# EAGLE design RFM69CW_BOB (EAGLE 6.4)
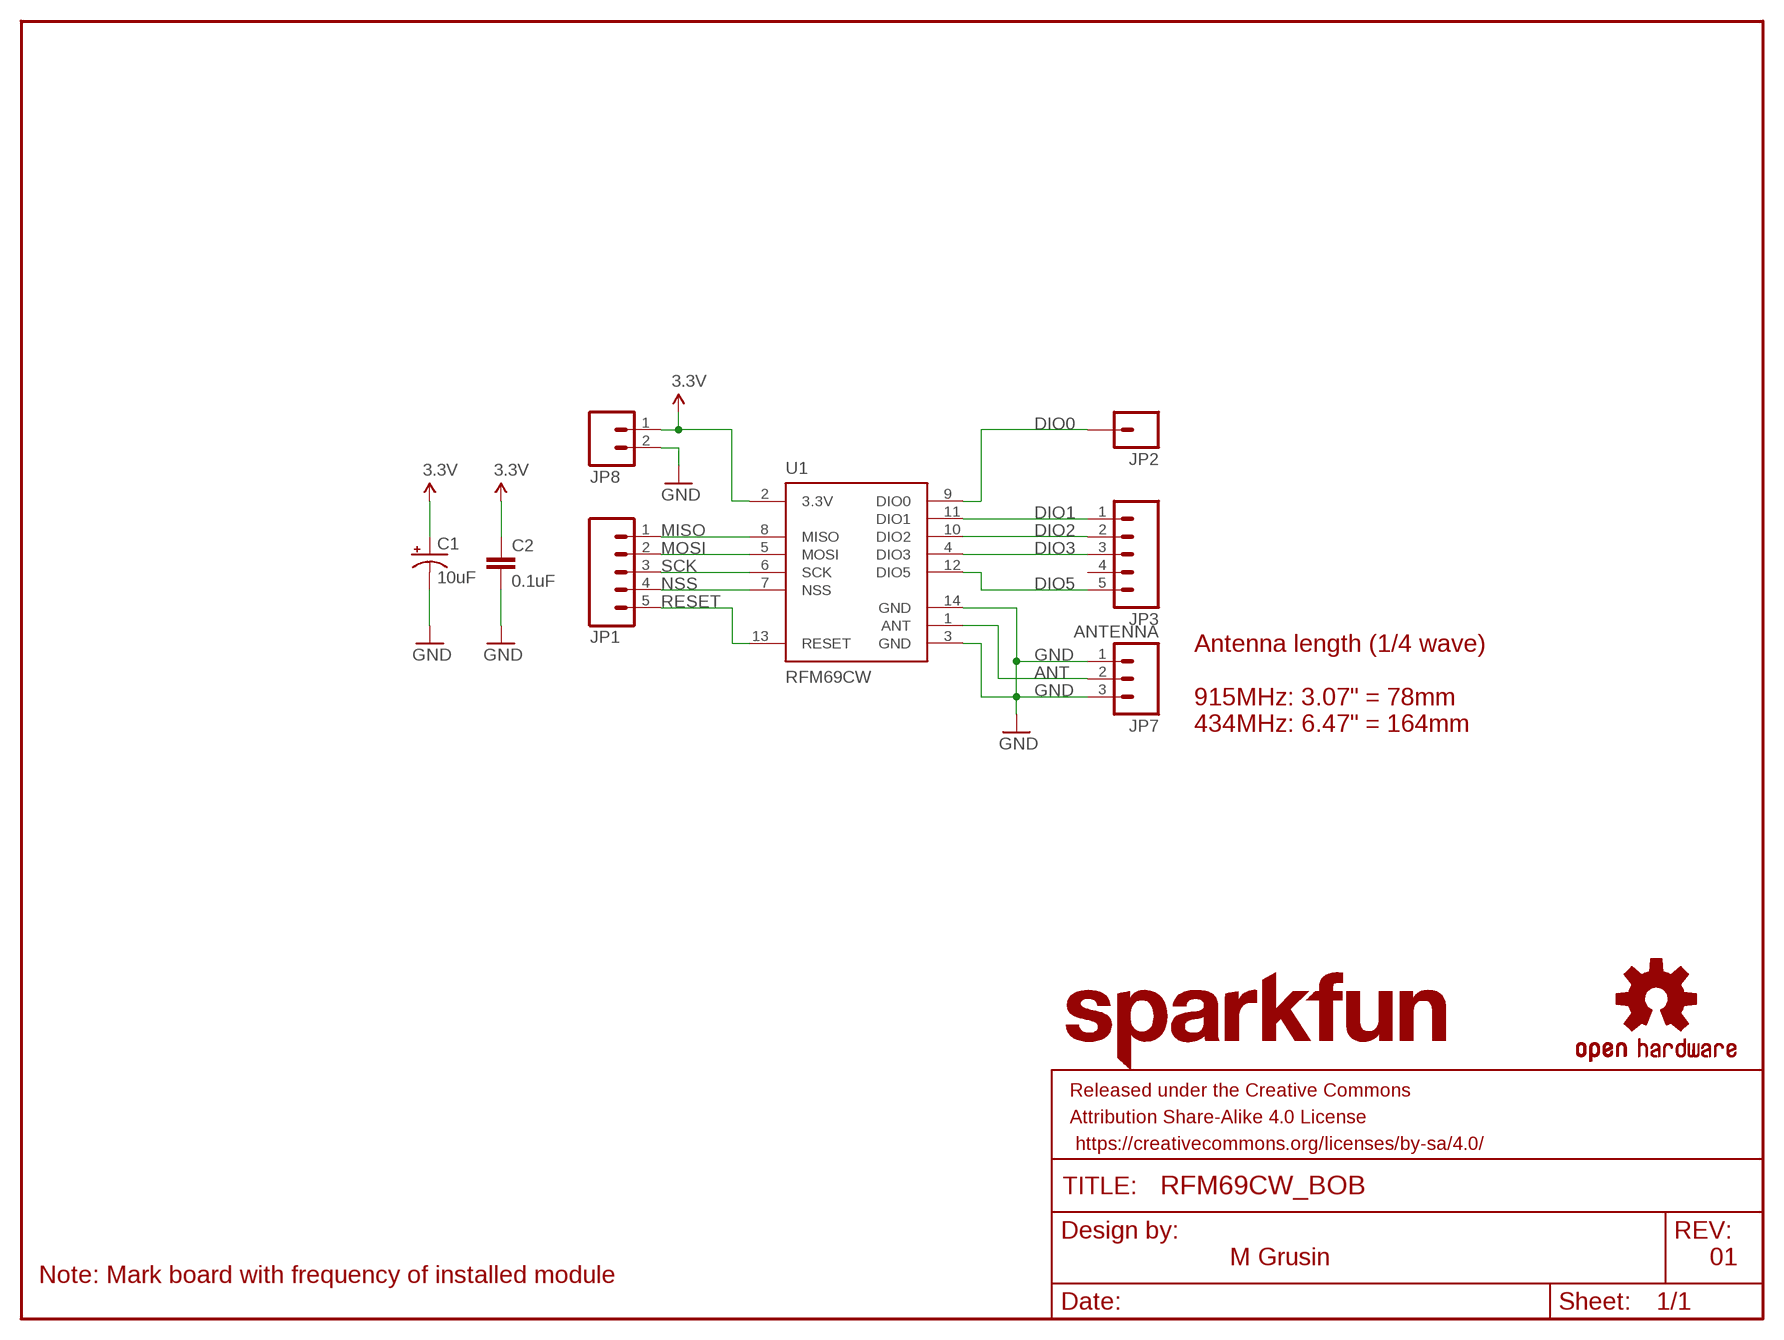
[diagram p0: schematic, sheet 1]

## Parts
C1  10uF  10UF-16V-10%(TANT)  [EIA3216]
C2  0.1uF  0.1UF-25V(+80/-20%)(0603)  [0603-CAP]
FRAME1  FRAME-LETTER  [CREATIVE_COMMONS]
JP1  M05_ROUNDONLY_NOSILK  [1X05_ROUNDONLY_NOSILK]
JP2  M01SMDNS  [1X01NS]
JP3  M05_ROUNDONLY_NOSILK  [1X05_ROUNDONLY_NOSILK]
JP7  ANTENNA  M03_ROUND_ONLY_NO_SILK  [1X03_ROUND_ONLY_NO_SILK]
JP8  M021X02_NO_SILK  [1X02_NO_SILK]
LOGO1  SFE_LOGO_NAME.1_INCH  [SFE_LOGO_NAME_.1]
LOGO2  OSHW-LOGOS  [OSHW-LOGO-S]
U1  RFM69CW  [RFM69CW-XXXS2]

## Nets
3.3V: C1.A(+) C2.1 JP8.1
ANT: JP7.2 U1.1(ANT)
DIO0: JP2.1 U1.9(DIO0)
DIO1: JP3.1 U1.11(DIO1)
DIO2: JP3.2 U1.10(DIO2)
DIO3: JP3.3 U1.4(DIO3)
DIO5: JP3.5 U1.12(DIO5)
GND: C1.C(-) C2.2 JP7.1 JP7.3 JP8.2 U1.3(GND) U1.14(GND)
MISO: JP1.1 U1.8(MISO)
MOSI: JP1.2 U1.5(MOSI)
NSS: JP1.4 U1.7(NSS)
RESET: JP1.5 U1.13(RESET)
SCK: JP1.3 U1.6(SCK)
Unconnected: JP3.4

## Notes on the sheet
- Antenna length (1/4 wave)
  
  915MHz: 3.07" = 78mm
  434MHz: 6.47" = 164mm
- M Grusin | 01
- Note: Mark board with frequency of installed module

## Power pins joined to a net without a drawn wire
3.3V: U1.2(3.3V)

## Library data of the parts
C1 = SparkFun-Capacitors:10UF-16V-10%(TANT): CAP-00811 1206/EIA-3216 Tantalum capacitor; PROD_ID: CAP-00811
C2 = SparkFun-Capacitors:0.1UF-25V(+80/-20%)(0603): CAP-00810 Ceramic Standard decoupling cap; PROD_ID: CAP-00810
FRAME1 = SparkFun-Aesthetics:FRAME-LETTER: Schematic Frame Standard 8.5x11 US Letter frame
JP1 JP3 = mike-temp:M05: Header 5 Standard 5-pin 0.1" header. Use with straight break away headers (SKU : PRT-00116), right angle break away headers (PRT-00553), swiss pins (PRT-00743), machine pins (PRT-00117), and female headers (PRT-00115). Molex polarized connector foot print use with SKU : PRT-08230 with associated crimp pins and housings.
JP2 = mike-temp:M01: Header 1 Standard 1-pin 0.1" header. Use with straight break away headers (SKU : PRT-00116), right angle break away headers (PRT-00553), swiss pins (PRT-00743), machine pins (PRT-00117), and female headers (PRT-00115).
JP7 = mike-temp:M03: Header 3 Standard 3-pin 0.1" header. Use with straight break away headers (SKU : PRT-00116), right angle break away headers (PRT-00553), swiss pins (PRT-00743), machine pins (PRT-00117), and female headers (PRT-00115). Molex polarized connector foot print use with SKU : PRT-08232 with associated crimp pins and housings.
JP8 = mike-temp:M02: Header 2 Standard 2-pin 0.1" header. Use with straight break away headers (SKU : PRT-00116), right angle break away headers (PRT-00553), swiss pins (PRT-00743), machine pins (PRT-00117), and female headers (PRT-00115). Molex polarized connector foot print use with SKU : PRT-08233 with associated crimp pins and housings.
LOGO1 = SparkFun-Aesthetics:SFE_LOGO_NAME: SFE Logo, name only This is the SparkFun name logo. The logo on the schematic will always be the same size; the package variant is the height of the flame part of the logo (or the height the flame would be, if it were drawn). Default layer for the logo on the board is tSilk.
LOGO2 = SparkFun-Aesthetics:OSHW-LOGO: Open Source Hardware Logo This logo indicates the piece of hardware it is found on incorporates a OSHW license and/or adheres to the definition of open source hardware found here: http://freedomdefined.org/OSHW
U1 = mike-temp:RFM69

## Board
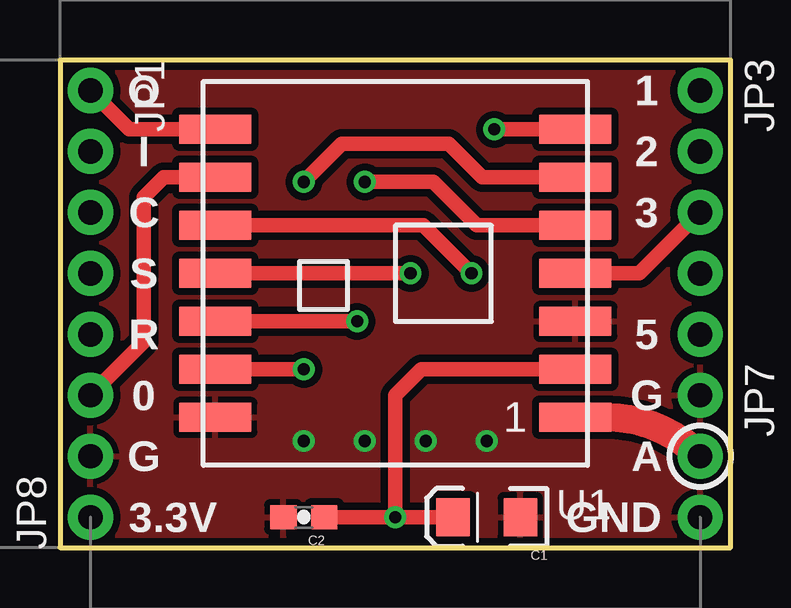
[diagram p1: board, top side]
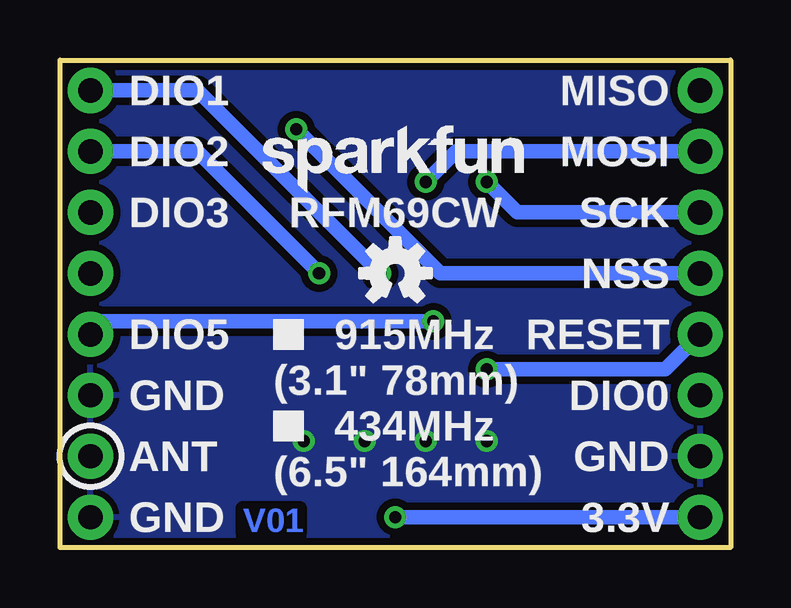
[diagram p2: board, bottom side, seen from below]

Size 27.94 x 20.32 mm. Coordinates in mm from the lower left corner, seen from the top.
Outline: 0,0 27.94,0 27.94,20.32 0,20.32 0,0
Copper layers (1*16): Top 0.035mm / dielectric 1.5mm / Bottom 0.035mm
Design rules "default *": minimum track width 10mil, minimum drill 24mil, track to track 8mil, track to pad 8mil, pad to pad 8mil, via to via 8mil, smd to smd 8mil, copper to edge 12mil, drill to drill 8mil, minimum pad ring 10mil, minimum via ring 8mil, stop-mask expansion 4mil, vias tented up to drill 0mil, thermal gap 10mil

### Footprints (pad centres in the part's own frame; a part is rotated, then mirrored left to right if it is on the bottom)
EIA3216 = smd 1.4 x 1.6: A 1.4,0; C -1.4,0
0603-CAP = smd 1.1 x 1: 1 -0.85,0; 2 0.85,0
1X05_ROUNDONLY_NOSILK = drill 1.016 pad 1.88: 1 0,0; 2 2.54,0; 3 5.08,0; 4 7.62,0; 5 10.16,0
1X01NS = drill 1.016 pad 1.88: 1 0,0
1X03_ROUND_ONLY_NO_SILK = drill 1.016 pad 1.88: 1 0,0; 2 2.54,0; 3 5.08,0
1X02_NO_SILK = drill 1.016 pad 1.88: 1 0,0; 2 2.54,0
RFM69CW-XXXS2 = smd 3 x 1.2: 1 -7.5,6; 2 -7.5,4; 3 -7.5,2; 4 -7.5,0; 5 -7.5,-2; 6 -7.5,-4; 7 -7.5,-6; 8 7.5,-6; 9 7.5,-4; 10 7.5,-2; 11 7.5,0; 12 7.5,2; 13 7.5,4; 14 7.5,6

### Placement (x,y rotation side)
C1  17.78,1.27 180 top
C2  10.16,1.27 180 top
FRAME1  -15.24,-12.7 0 top  (outside the outline)
JP1  1.27,19.05 270 top
JP2  1.27,6.35 0 top
JP3  26.67,19.05 270 top
JP7  26.67,6.35 270 top
JP8  1.27,1.27 90 top
LOGO1  20,14.29 0 bottom
LOGO2  13.97,11.43 0 bottom
U1  13.97,11.43 180 top

### Tracks (layer width: path | path; a pad name or v marks a point on that pad's centre or on a via)
3.3V  (via drill 0.51)
  Top 0.61: v13.97,1.27 C1.A | v13.97,1.27 C2.1 | U1.2 15.05,7.43 13.97,6.35 v13.97,1.27
  Bottom 0.61: JP8.1 v13.97,1.27
ANT
  Top 1.194: U1.1 22.76,5.43 arc-45 JP7.2
DIO0
  Top 0.61: U1.9 4.32,15.43 3.49,14.61 3.49,8.57 JP2.1
DIO1  (via drill 0.51)
  Top 0.61: U1.11 v14.61,11.43
  Bottom 0.61: v14.61,11.43 22.23,19.05 JP3.1
DIO2  (via drill 0.51)
  Top 0.61: U1.10 15.14,13.43 v17.14,11.43
  Bottom 0.61: v17.14,11.43 22.23,16.51 JP3.2
DIO3
  Top 0.61: U1.4 24.13,11.43 JP3.3
DIO5  (via drill 0.51)
  Top 0.61: U1.12 v12.38,9.43
  Bottom 0.61: JP3.5 26.13,9.43 v12.38,9.43
GND  (via drill 0.51)
  other vias: 17.78,4.45 10.16,4.45 12.7,4.45 15.24,4.45
  pour Bottom (isolate 0.305): 0,20.32 27.94,20.32 27.94,0 0,0
  pour Top (isolate 0.305): 0,20.32 27.94,20.32 27.94,0 0,0
MISO
  Top 0.61: U1.8 2.89,17.43 JP1.1
MOSI  (via drill 0.51)
  Top 0.61: U1.5 17.37,13.43 15.56,15.24 v12.7,15.24
  Bottom 0.61: JP1.2 11.43,16.51 v12.7,15.24
NSS  (via drill 0.51)
  Top 0.61: U1.7 v18.1,17.43
  Bottom 0.61: JP1.4 12.1,11.43 v18.1,17.43
RESET  (via drill 0.51)
  Top 0.61: U1.13 v10.16,7.43
  Bottom 0.61: v10.16,7.43 2.73,7.43 JP1.5
SCK  (via drill 0.51)
  Top 0.61: U1.6 17.59,15.43 16.19,16.83 11.75,16.83 v10.16,15.24
  Bottom 0.61: v10.16,15.24 8.89,13.97 JP1.3

### Text on the board
Bottom: V01
tPlace: O | 1 | I | 2 | C | 3 | S | R | 5 | 0 | G | G | A | 3.3V | GND
bPlace: MISO | DIO1 | MOSI | DIO2 | SCK | RFM69CW | DIO3 | NSS | RESET | 915MHz | DIO5 | DIO0 | (3.1" 78mm) | GND | 434MHz | GND | (6.5" 164mm) | ANT | 3.3V | GND
tDocu: M Grusin